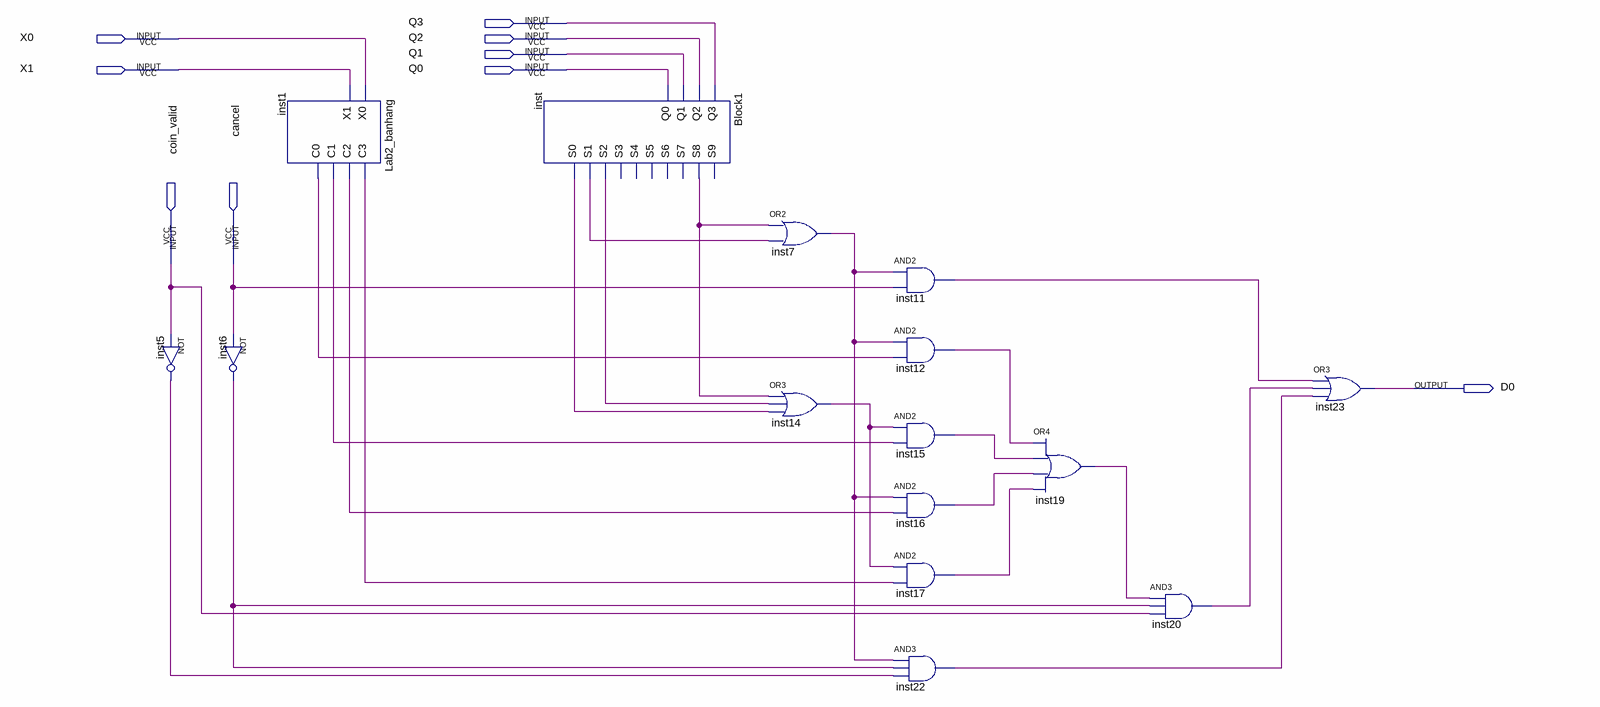
[diagram p0: schematic sheet]
// Quartus schematic block9.bdf as structural Verilog: 15 symbols, 9 pins
module block9 (
  input  Q3,
  input  X0,
  input  Q2,
  input  Q1,
  input  X1,
  input  Q0,
  input  coin_valid,
  input  cancel,
  output D0
);

  wire inst1_c0, inst1_c1, inst1_c2, inst1_c3, inst5_out, inst6_out, inst7_out, inst11_out, inst12_out,
       inst14_out, inst15_out, inst16_out, inst17_out, inst19_out, inst20_out, inst22_out, inst_s0, inst_s1,
       inst_s2, inst_s8;

  not inst5 (inst5_out, coin_valid);
  not inst6 (inst6_out, cancel);
  Lab2_banhang inst1 (.X0(X0), .X1(X1), .C3(inst1_c3), .C2(inst1_c2), .C1(inst1_c1), .C0(inst1_c0));
  Block1 inst (
    .Q3(Q3), .Q2(Q2), .Q1(Q1), .Q0(Q0), .S8(inst_s8), .S2(inst_s2), .S1(inst_s1), .S0(inst_s0));  // open: S9, S7, S6, S5, S4, S3
  or inst7 (inst7_out, inst_s8, inst_s1);
  or inst14 (inst14_out, inst_s8, inst_s2, inst_s0);
  and inst11 (inst11_out, inst7_out, cancel);
  and inst12 (inst12_out, inst7_out, inst1_c0);
  and inst15 (inst15_out, inst14_out, inst1_c1);
  and inst16 (inst16_out, inst7_out, inst1_c2);
  and inst17 (inst17_out, inst14_out, inst1_c3);
  and inst22 (inst22_out, inst7_out, inst6_out, inst5_out);
  or inst19 (inst19_out, inst12_out, inst15_out, inst16_out, inst17_out);
  and inst20 (inst20_out, inst19_out, inst6_out, coin_valid);
  or inst23 (D0, inst11_out, inst20_out, inst22_out);
endmodule
